# EAGLE design Microcore_dip16_1 (EAGLE 6.1)
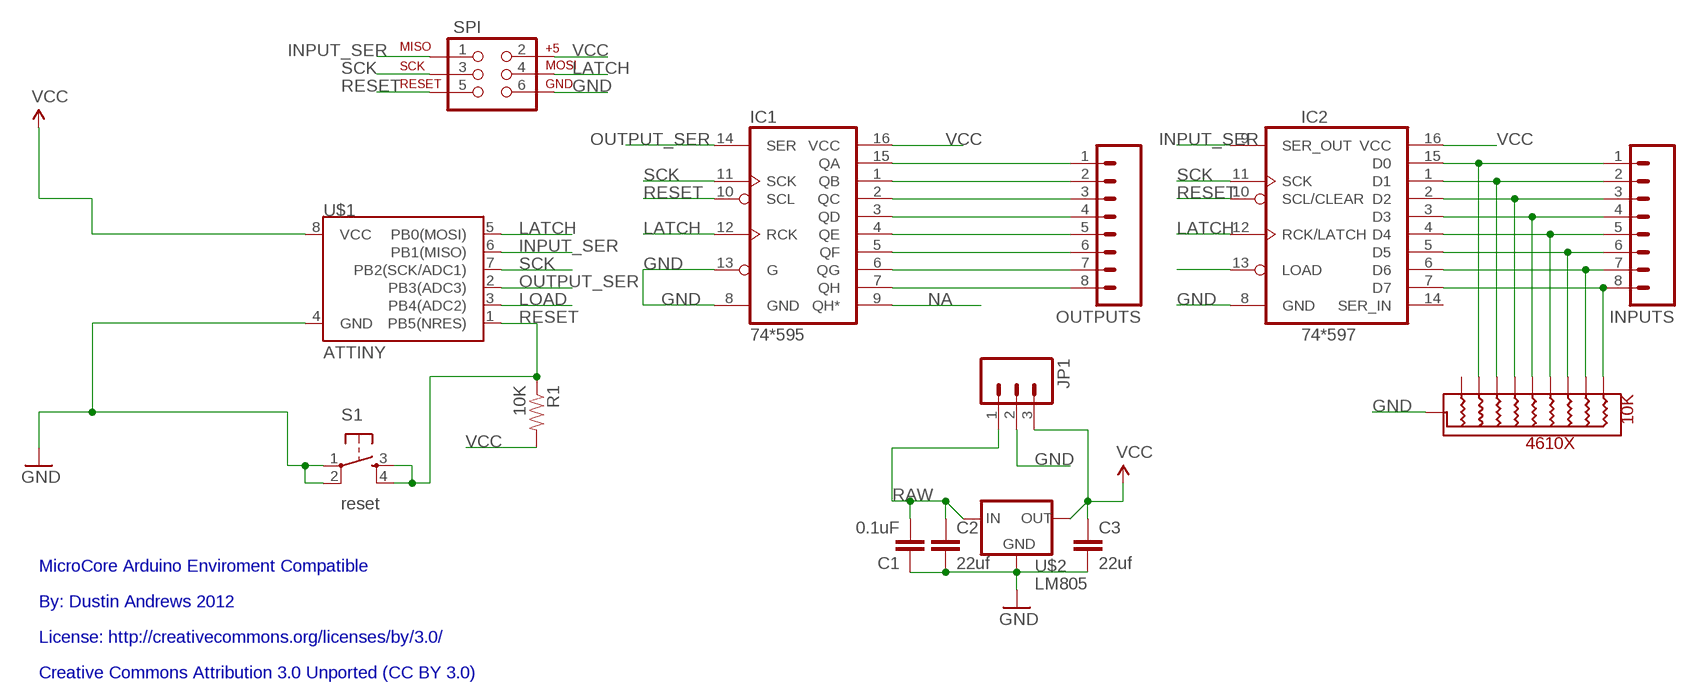
[diagram p0: schematic, sheet 1]

## Parts
10K  4610X  [10-SIP]
C1  0.1uF  CAPPTH  [CAP-PTH-SMALL]
C2  22uf  CAPPTH  [CAP-PTH-SMALL]
C3  22uf  CAPPTH  [CAP-PTH-SMALL]
IC1  74*595  74LS595N  [DIL16]
IC2  74*597  7459716DIP  [DIL16]
INPUTS  M08LONGPADS  [1X08_LONGPADS]
JP1  M03PTH  [1X03]
OUTPUTS  M08LONGPADS  [1X08_LONGPADS]
R1  10K  RESISTORPTH-1/4W  [AXIAL-0.4]
S1  reset  TAC_SWITCHPTH  [TACTILE-PTH]
SPI  AVR_SPI_PRG_6NS  [2X3-NS]
U$1  ATTINY  ATTINY13DIP  [DIP08]
U$2  LM805  V_REG_78XXSINK  [TO220-IGO]

## Nets
GND: 10K.P$1(GND) C1.1 C2.2 C3.2 IC1.8(GND) IC1.13(G) IC2.8(GND) JP1.2 S1.1 S1.2 SPI.6 U$1.4(GND) U$2.GND
INPUT_SER: IC2.9(SER_OUT) SPI.1 U$1.6(PB1(MISO))
LATCH: IC1.12(RCK) IC2.12(RCK/LATCH) SPI.4 U$1.5(PB0(MOSI))
LOAD: IC2.13(LOAD) U$1.3(PB4(ADC2))
N$1: IC1.15(QA) OUTPUTS.1
N$2: IC1.1(QB) OUTPUTS.2
N$3: IC1.2(QC) OUTPUTS.3
N$4: IC1.3(QD) OUTPUTS.4
N$5: IC1.4(QE) OUTPUTS.5
N$6: IC1.5(QF) OUTPUTS.6
N$7: IC1.6(QG) OUTPUTS.7
N$8: IC1.7(QH) OUTPUTS.8
N$9: 10K.P$3 IC2.15(D0) INPUTS.1
N$10: 10K.P$4 IC2.1(D1) INPUTS.2
N$11: 10K.P$5 IC2.2(D2) INPUTS.3
N$12: 10K.P$6 IC2.3(D3) INPUTS.4
N$13: 10K.P$7 IC2.4(D4) INPUTS.5
N$14: 10K.P$8 IC2.5(D5) INPUTS.6
N$15: 10K.P$9 IC2.6(D6) INPUTS.7
N$16: 10K.P$10 IC2.7(D7) INPUTS.8
NA: IC1.9(QH*)
OUTPUT_SER: IC1.14(SER) U$1.2(PB3(ADC3))
RAW: C1.2 C2.1 JP1.1 U$2.IN
RESET: IC1.10(SCL) IC2.10(SCL/CLEAR) R1.P$1 S1.3 S1.4 SPI.5 U$1.1(PB5(NRES))
SCK: IC1.11(SCK) IC2.11(SCK) SPI.3 U$1.7(PB2(SCK/ADC1))
VCC: C3.1 IC1.16(VCC) IC2.16(VCC) JP1.3 R1.P$2 SPI.2 U$1.8(VCC) U$2.OUT
Unconnected: 10K.P$2 IC2.14(SER_IN)

## Notes on the sheet
- MicroCore Arduino Enviroment Compatible
- By: Dustin Andrews 2012
- License: http://creativecommons.org/licenses/by/3.0/
- Creative Commons Attribution 3.0 Unported (CC BY 3.0)

## Library data of the parts
10K = Dustin:4610X: RESISTOR ARRAY 10PIN BUSSED
C1-C3 = SparkFun:CAP: Capacitor Standard 0603 ceramic capacitor, and 0.1" leaded capacitor.
IC1 = SparkFun:74*595: 8-bit SHIFT REGISTER, output latch
IC2 = Dustin:74*597: Input Shift Register 74*597 input shift register Parallel to serial data input with latch
INPUTS OUTPUTS = SparkFun:M08: Header 8 Standard 8-pin 0.1" header. Use with straight break away headers (SKU : PRT-00116), right angle break away headers (PRT-00553), swiss pins (PRT-00743), machine pins (PRT-00117), and female headers (PRT-00115).
JP1 = SparkFun:M03: Header 3 Standard 3-pin 0.1" header. Use with straight break away headers (SKU : PRT-00116), right angle break away headers (PRT-00553), swiss pins (PRT-00743), machine pins (PRT-00117), and female headers (PRT-00115). Molex polarized connector foot print use with SKU : PRT-08232 with associated crimp pins and housings.
R1 = SparkFun:RESISTOR: Resistor Basic schematic elements and footprints for 0603, 1206, and PTH resistors.
S1 = SparkFun:TAC_SWITCH: Momentary Switch Button commonly used for reset or general input. Spark Fun Electronics SKU : COM-00097
SPI = SparkFun:AVR_SPI_PRG_6: AVR ISP 6 Pin This is the reduced ISP connector for AVR programming. Common on Arduino. This footprint will take up less PCB space and can be used with a 10-pin to 6-pin adapter such as SKU: BOB-08508
U$1 = SparkFun:ATTINY13
U$2 = SparkFun:V_REG_78XX: Voltage Regulator Standard 7805 5V regulator. IGO (Input Ground Output). Spark Fun Electronics SKU : COM-00107

## Board
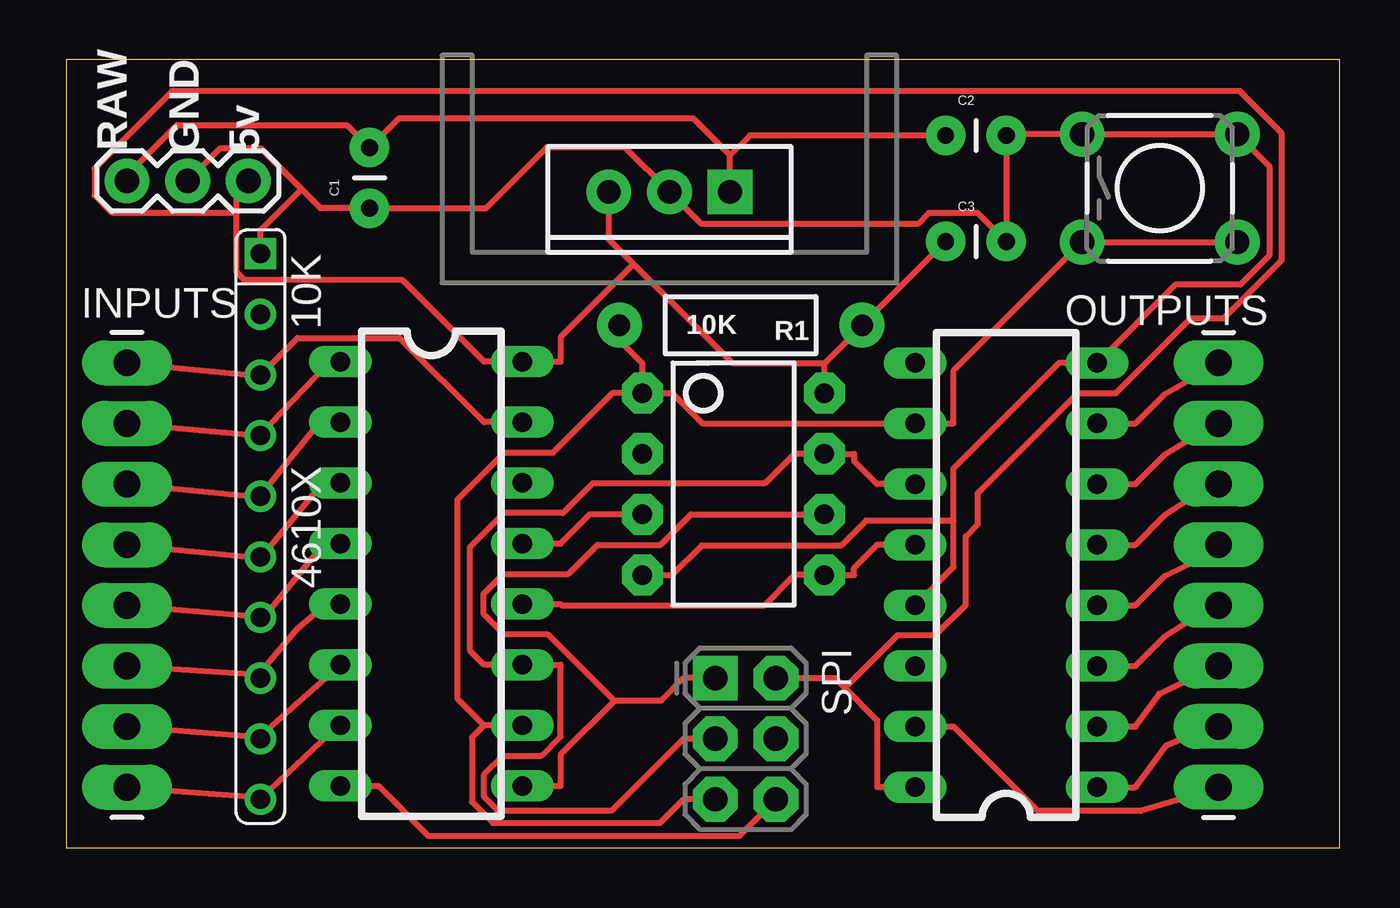
[diagram p1: board, top side]
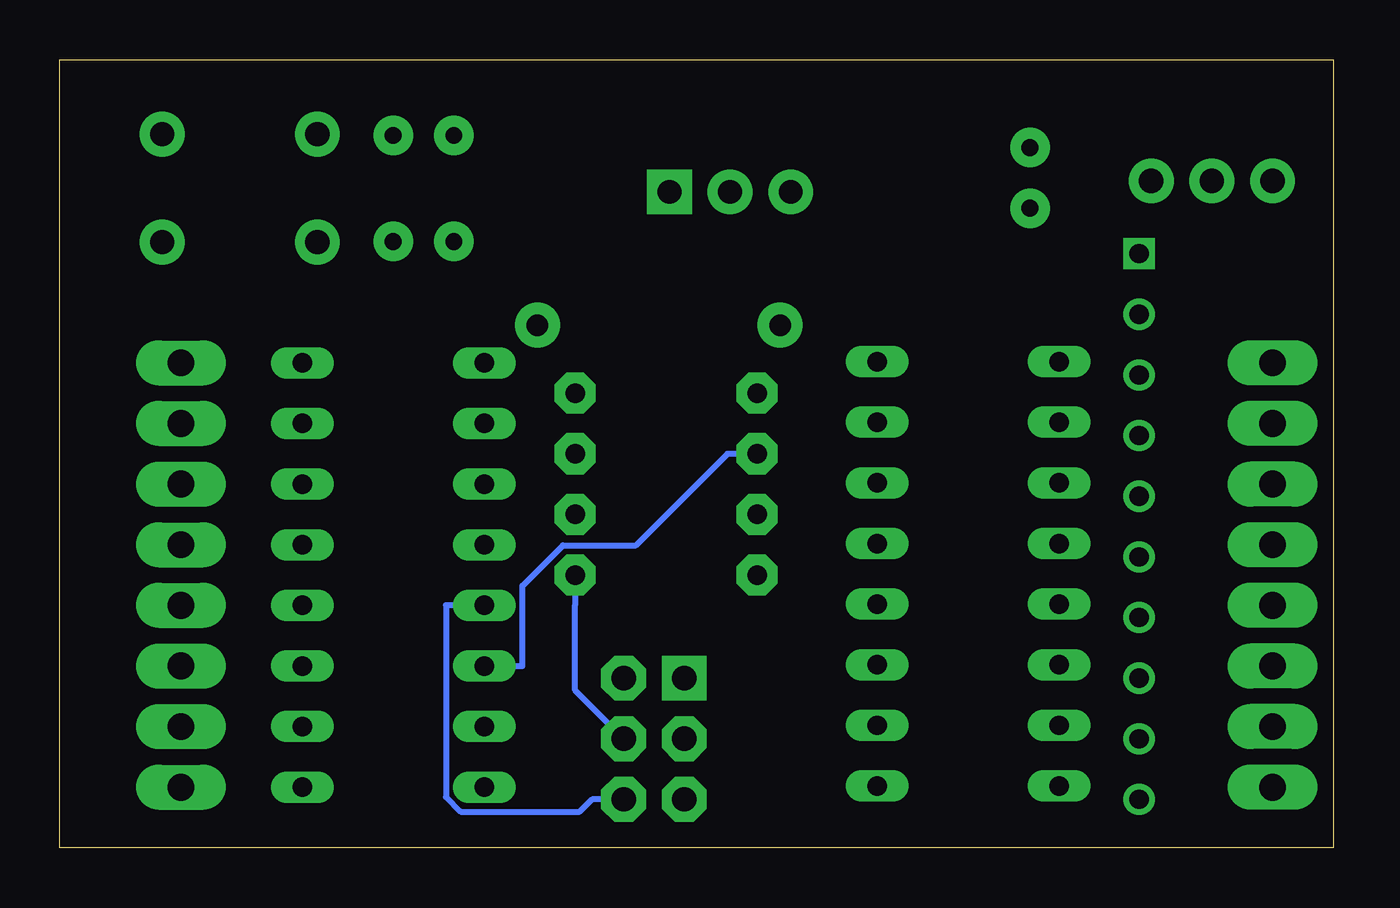
[diagram p2: board, bottom side, seen from below]

Size 53.34 x 33.02 mm. Coordinates in mm from the lower left corner, seen from the top.
Outline: 0,0 53.34,0 53.34,33.02 0,33.02 0,0
Copper layers (1*16): Top 0.035mm / dielectric 1.5mm / Bottom 0.035mm
Design rules: minimum track width 10mil, minimum drill 24mil, track to track 8mil, track to pad 8mil, pad to pad 8mil, via to via 8mil, smd to smd 8mil, copper to edge 40mil, drill to drill 8mil, minimum pad ring 10mil, minimum via ring 8mil, stop-mask expansion 4mil, vias tented up to drill 0mil, thermal gap 10mil

### Footprints (pad centres in the part's own frame; a part is rotated, then mirrored left to right if it is on the bottom)
10-SIP = drill 0.8 square: P$1 0,0 | drill 0.8: P$2 2.54,0; P$3 5.08,0; P$4 7.62,0; P$5 10.16,0; P$6 12.7,0; P$7 15.24,0; P$8 17.78,0; P$9 20.32,0; P$10 22.86,0
CAP-PTH-SMALL = drill 0.7 pad 1.651: 1 0,0; 2 2.54,0
DIL16 = drill 0.813 long: 1 -8.89,-3.81; 2 -6.35,-3.81; 3 -3.81,-3.81; 4 -1.27,-3.81; 5 1.27,-3.81; 6 3.81,-3.81; 7 6.35,-3.81; 8 8.89,-3.81; 9 8.89,3.81; 10 6.35,3.81; 11 3.81,3.81; 12 1.27,3.81; 13 -1.27,3.81; 14 -3.81,3.81; 15 -6.35,3.81; 16 -8.89,3.81
DIL16' = drill 0.813 long: 1 -7.62,-3.81; 2 -5.08,-3.81; 3 -2.54,-3.81; 4 0,-3.81; 5 2.54,-3.81; 6 5.08,-3.81; 7 7.62,-3.81; 8 10.16,-3.81; 9 10.16,3.81; 10 7.62,3.81; 11 5.08,3.81; 12 2.54,3.81; 13 0,3.81; 14 -2.54,3.81; 15 -5.08,3.81; 16 -7.62,3.81
1X08_LONGPADS = drill 1.118 pad 1.88 long: 1 0,0; 2 2.54,0; 3 5.08,0; 4 7.62,0; 5 10.16,0; 6 12.7,0; 7 15.24,0; 8 17.78,0
1X03 = drill 1.016 pad 1.88: 1 0,0; 2 2.54,0; 3 5.08,0
AXIAL-0.4 = drill 0.9 pad 1.88: P$1 -5.08,0; P$2 5.08,0
TACTILE-PTH = drill 1.016 pad 1.88: 1 -3.251,2.261; 2 3.251,2.261; 3 -3.251,-2.261; 4 3.251,-2.261
2X3-NS = drill 1.016 pad 1.88 square: 1 -2.54,-1.27 | drill 1.016 pad 1.88 octagon: 2 -2.54,1.27; 3 0,-1.27; 4 0,1.27; 5 2.54,-1.27; 6 2.54,1.27
DIP08 = drill 0.813 pad 1.727 octagon: 1 -3.81,-3.81; 2 -1.27,-3.81; 3 1.27,-3.81; 4 3.81,-3.81; 5 3.81,3.81; 6 1.27,3.81; 7 -1.27,3.81; 8 -3.81,3.81
TO220-IGO = drill 1 pad 1.88: GND 0,0; OUT 2.54,0 | drill 1 pad 1.88 square: IN -2.54,0

### Placement (x,y rotation side)
10K  8.13,24.89 270 top
C1  12.7,26.8 90 top
C2  36.83,29.84 0 top
C3  36.83,25.4 0 top
IC1  39.37,11.43 90 top
IC2  74*597  [DIL16']  15.29,12.75 270 top
INPUTS  2.54,20.32 270 top
JP1  2.54,27.94 0 top
OUTPUTS  48.26,2.54 90 top
R1  28.24,21.89 0 top
S1  45.8,27.64 0 top
SPI  28.45,4.57 270 top
U$1  27.94,15.24 270 top
U$2  25.26,27.48 180 top

### Tracks (layer width: path | path; a pad name or v marks a point on that pad's centre or on a via)
GND
  Top 0.254: 37.16,13.72 37.16,15.9 41.58,20.32 IC1.8 46.46,23.6 49.17,23.6 50.38,24.81 50.38,28.57 S1.2 S1.1 39.42,29.9 C2.2 C3.2 38.16,26.61 36.13,26.61 35.68,26.16 26.58,26.16 U$2.GND 23.38,29.36 20.14,29.36 17.58,26.8 C1.1 10.65,26.8 9.85,27.59 | IC1.13 37.16,11.76 37.16,13.72 | 37.16,13.72 33.51,13.72 32.46,12.68 26.62,12.68 25.38,11.43 U$1.4 | JP1.2 6.45,29.31 8.13,29.31 9.85,27.59 | 9.85,27.59 8.13,25.88 10K.P$1 | IC2.8 13.08,2.59 15.18,0.49 28.18,0.49 SPI.6
  Bottom 0.254: SPI.6 31.04,2.03 31.56,1.51 36.55,1.51 37.16,2.13 37.16,10.16 IC1.13
INPUT_SER
  Top 0.254: IC2.9 20.7,2.59 20.7,3.91 22.96,6.17 | 22.96,6.17 20.18,8.94 18.34,8.94 17.47,9.81 17.47,10.63 18.32,11.48 21.03,11.48 22.25,12.7 24.89,12.7 26.16,13.97 U$1.6 | 22.96,6.17 24.91,6.17 25.86,7.11 SPI.1
LATCH
  Top 0.254: IC1.12 33.96,12.7 32.99,11.73 32.99,11.43 U$1.5 31.66,11.43 30.5,11.43 29.22,10.14 20.77,10.14 20.7,10.21 IC2.12
  Bottom 0.254: SPI.4 31.75,6.6 31.75,10.19 U$1.5
LOAD
  Top 0.254: IC2.13 20.7,12.75 21.92,13.97 22.89,13.97 U$1.3
N$1
  Top 0.254: IC1.15 37.16,5.08 40.69,1.55 45.01,1.55 48.23,2.49 OUTPUTS.1
N$2
  Top 0.254: OUTPUTS.2 48.08,5.08 46.05,4.27 44.78,2.54 IC1.1
N$3
  Top 0.254: OUTPUTS.3 48.21,7.62 45.77,6.45 44.78,5.08 IC1.2
N$4
  Top 0.254: OUTPUTS.4 48.21,10.24 46,8.84 44.78,7.62 IC1.3
N$5
  Top 0.254: OUTPUTS.5 48.36,12.52 46,11.38 44.78,10.16 IC1.4
N$6
  Top 0.254: OUTPUTS.6 48.18,15.34 46,13.92 44.78,12.7 IC1.5
N$7
  Top 0.254: OUTPUTS.7 48.31,17.86 46,16.46 44.78,15.24 IC1.6
N$8
  Top 0.254: OUTPUTS.8 48.23,20.27 46,19 44.78,17.78 IC1.7
N$9
  Top 0.254: INPUTS.1 8.13,19.76 10K.P$3 9.68,21.36 13.97,21.36 17.5,17.83 IC2.15
N$10
  Top 0.254: 8.08,17.27 10K.P$4 | INPUTS.2 8.08,17.27 | 8.08,17.27 10.92,20.24 11.48,20.4 IC2.1
N$11
  Top 0.254: 8.08,14.71 10K.P$5 | INPUTS.3 8.08,14.71 | 8.08,14.71 10.64,17.88 11.1,17.83 IC2.2
N$12
  Top 0.254: 8.13,12.14 10K.P$6 | INPUTS.4 8.13,12.14 | 8.13,12.14 10.52,15.04 11.46,15.29 IC2.3
N$13
  Top 0.254: 8.28,9.68 10K.P$7 | INPUTS.5 8.28,9.68 | 8.28,9.68 10.79,12.75 11.15,12.75 IC2.4
N$14
  Top 0.254: 8.05,7.26 10K.P$8 | INPUTS.6 8.05,7.26 | 8.05,7.26 9.65,9.14 10.95,10.26 IC2.5
N$15
  Top 0.254: 8.08,4.65 10K.P$9 | INPUTS.7 8.08,4.65 | 8.08,4.65 11.43,7.62 11.2,7.64 IC2.6
N$16
  Top 0.254: 8.2,2.11 10K.P$10 | INPUTS.8 8.2,2.11 | 8.2,2.11 11.38,5.11 11.4,5.08 IC2.7
OUTPUT_SER
  Bottom 0.254: IC1.14 33.96,7.62 33.96,10.98 32.27,12.68 29.21,12.68 25.38,16.51 U$1.2
RAW
  Top 0.254: JP1.1 2.54,28.19 4.62,30.28 11.73,30.28 11.79,30.23 11.81,30.23 C1.2 13.92,30.56 26.26,30.56 27.8,29.02 | U$2.IN 27.8,29.02 | C2.1 28.63,29.84 27.8,29.02
RESET
  Top 0.254: S1.4 S1.3 37.16,19.99 37.16,17.78 IC1.10 26.64,17.78 25.38,19.05 U$1.1 | 17.5,5.13 16.38,6.25 16.38,14.59 18.35,16.56 20.4,16.56 22.89,19.05 U$1.1 | 17.5,5.13 16.99,4.62 16.99,1.93 17.87,1.05 24.87,1.05 25.86,2.03 SPI.5 | U$1.1 24.13,19.67 24.13,20.3 23.16,21.26 R1.P$1 | IC2.10 17.5,5.13
SCK
  Top 0.254: IC1.11 33.96,15.24 32.99,16.2 32.99,16.51 U$1.7 31.49,16.51 30.5,16.51 29.26,15.27 22.05,15.27 20.8,14.02 18.33,14.02 16.89,12.58 16.89,8.28 17.5,7.67 IC2.11 20.7,7.67 20.7,4.67 19.9,3.86 18.29,3.86 17.5,3.07 17.5,2.14 18.08,1.55 22.84,1.55 25.86,4.57 SPI.3
VCC
  Top 0.254: 32.61,6.7 34.82,8.91 36.41,8.91 37.67,10.18 37.67,13.05 38.18,13.56 38.18,14.86 42.37,19.05 43.97,19.05 47.1,22.18 48.48,22.18 50.91,24.62 50.91,29.95 49.15,31.7 4.43,31.7 1.19,28.46 1.19,27.34 1.91,26.62 7.13,26.62 | 23.75,24.45 22.72,25.49 U$2.OUT | 31.75,20.3 27.91,20.3 23.75,24.45 | 23.75,24.45 20.7,21.4 20.7,20.37 IC2.16 17.5,20.37 14.09,23.78 7.47,23.78 7.13,24.12 7.13,26.62 | 7.13,26.62 7.13,27.45 JP1.3 | 32.61,6.7 33.96,5.35 33.96,2.54 IC1.16 | 32.61,6.7 32.19,7.11 31.04,7.11 SPI.2 | C3.1 R1.P$2 33.33,21.87 31.75,20.3 | U$1.8 31.75,20.3

### Text on the board
tPlace: RAW | GND | 5v
tValues: 1 | 1 | 2 | 2 | 3 | 3 | 4 | 4 | 5 | 5 | 6 | 6 | 7 | 7 | 8 | 8